# EasyEDA Pro project 000.1.CheeseCake_Special remake_AUX.epro

# Board Special remake_3
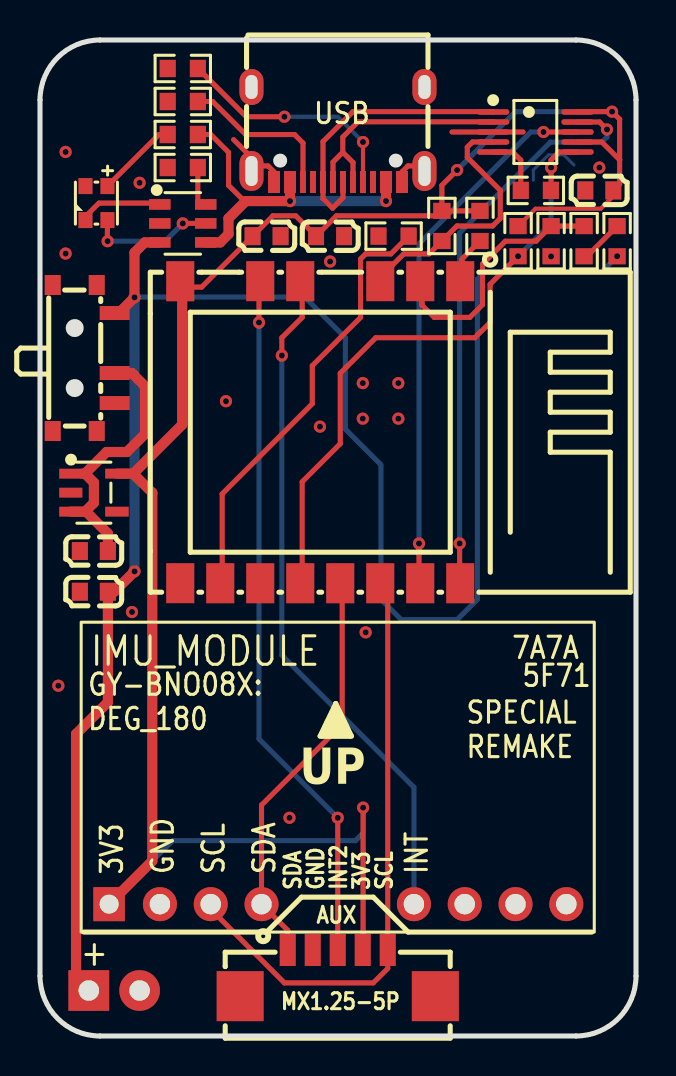
[diagram p0: board, top side]
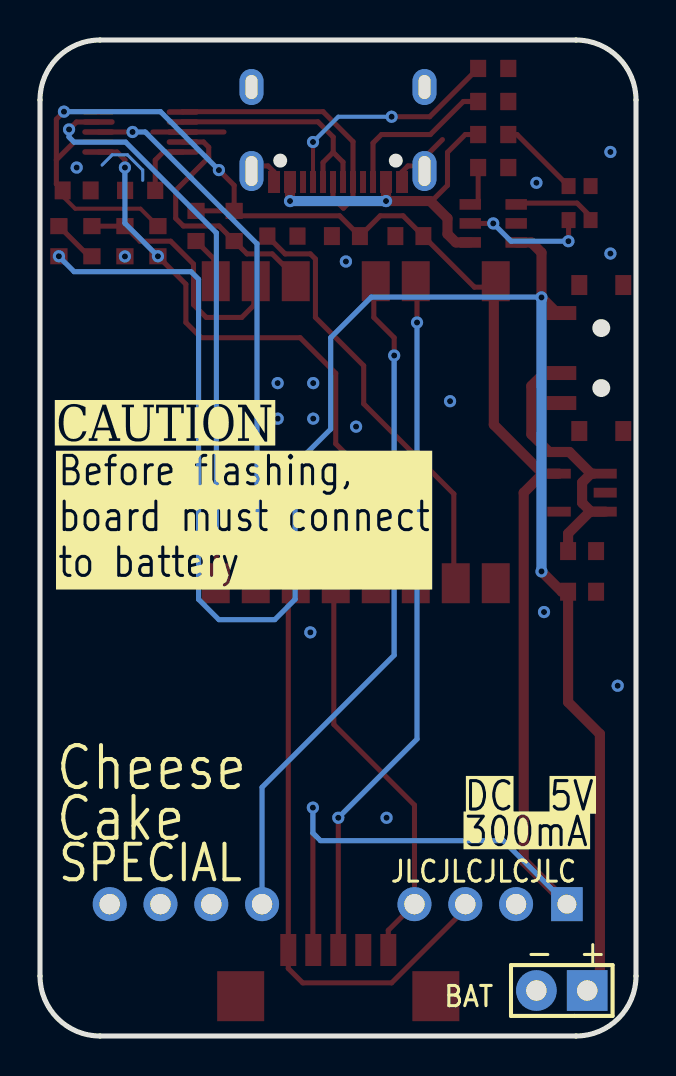
[diagram p1: board, bottom side, seen from below]

Outline 29.8 x 49.8 mm; copper layers: Top Layer, Bottom Layer. Coordinates in mm from the lower left corner of the outline.
Outline path: 0,46.8 arc(0.88,48.92) 3,49.8 26.8,49.8 arc(28.92,48.92) 29.8,46.8 29.8,3 arc(28.92,0.88) 26.8,0 3,0 arc(0.88,0.88) 0,3 0,46.8
Stack: Top Layer 0.035mm / Dielectric1 0.91mm FR4 er 4.5 / Bottom Layer 0.035mm

## Design rules (mm)
spacing Default (default): track to track 0.127, other pairs 0 to 0.127
track width Default (default): min 0.127, default 0.127, max 25.4
differential pair differentialPair (default): width min 0.127, default 0.254, max 2.54; gap min 0.152, default 0.152
via Default (default): diameter min 0.61, default 0.61, max 100.025; hole min 0.305, default 0.305, max 59.995
net GND uses gge20888(1)

## Placement (name value [footprint] x y rotation side)
BAT  HDR-M-2.54_1x2  [hdr-m-2.54_1x2]  3.71 2.28 0 bottom
C1  1uF  [C0603]  11.33 39.99 180 top
C2  100nF  [C0603]  14.5 39.99 180 top
C3  100nF  [C0603]  27.97 42.28 0 top
C5  1uF  [C0603]  2.69 24.25 0 top
CN1  HC-1.25-5PWT  [conn-smd_5p-p1.25_hctl_hc-1.25-5pwt]  14.89 3.29 0 top
CONN1  -  [hdr-th_10p-p2.54-v-m-1]  14.89 6.59 0 top
CP  10uF  [C0603]  2.69 22.21 0 top
ESP1  2.4GHz  [wifim-smd_esp-12f-esp8266mod]  13.36 30.19 180 top
LDO3V3  ME6211C33M5G-N  [SOT-23-5_L3.0-W1.7-P0.95-LS2.8-BL]  2.69 27.17 270 top
LED  NH-B2020RGBA-HF  [LED-ARRAY-SMD_4P-L2.1-W2.1-TL_NH-B2020RGBA]  2.82 41.65 90 top
P1  TP4057-42-SOT26-R  [SOT-23-6_L2.9-W1.6-P0.95-LS2.8-BL]  7.14 40.63 270 top
R1  4.7kΩ  [R0603]  20.09 40.5 90 top
R2  4.7kΩ  [R0603]  22 40.5 90 top
R3  4.7kΩ  [R0603]  23.9 39.74 90 top
R10  4.7kΩ  [R0603]  24.79 42.28 0 top
RA  3kΩ  [R0603]  7.14 43.42 180 top
RD  4.7kΩ  [R0603]  17.68 39.99 180 top
RD1  5.1kΩ  [R0603]  7.14 48.38 0 top
RD2  5.1kΩ  [R0603]  7.14 46.73 0 top
RL  1kΩ  [R0603]  7.14 45.07 0 top
RS  180kΩ  [R0603]  28.86 39.74 90 top
SW  SSSS811101  [SW-SMD_SSSS811101]  2.19 33.9 270 top
UART1  CH340X  [MSOP-10_L3.0-W3.0-P0.50-LS5.0-BL]  24.77 45.2 270 top
USB  TYPE-C 16PIN 2MD(073)  [USB-C-SMD_TYPE-C-6PIN-2MD-073]  14.9 45.07 180 top
VD1  220kΩ  [R0603]  27.21 39.74 270 top
VD2  100kΩ  [R0603]  25.55 39.74 90 top

## Footprints (pads in the part's own frame, mm; a bottom-side part is the same pattern mirrored in y, then rotated)
C0603
  rect 0.8x0.9 smd: 1(-0.7,0) 2(0.7,0)
conn-smd_5p-p1.25_hctl_hc-1.25-5pwt
  rect 0.8x1.6 smd: 1(-2.5,1.009) 2(-1.25,1.009) 3(0,1.009) 4(1.25,1.009) 5(2.5,1.009)
  rect 2.35x2.5 smd: 6(4.88,-1.3) 7(-4.88,-1.3)
hdr-m-2.54_1x2
  rect 2.032x2.032 hole 1.021: 1(-1.27,0)
  round 2.032 hole 1.021: 2(1.27,0)
hdr-th_10p-p2.54-v-m-1
  rect 1.575x1.7 hole 0.945: 1(-11.43,0)
  round 1.7 hole 1.02: 2(-8.89,0) 3(-6.35,0) 4(-3.81,0) 7(3.81,0) 8(6.35,0) 9(8.89,0) 10(11.43,0)
LED-ARRAY-SMD_4P-L2.1-W2.1-TL_NH-B2020RGBA
  rect 0.8x0.7 smd: 1(-0.85,0.55) 2(0.85,0.55) 3(0.85,-0.55) 4(-0.85,-0.55)
MSOP-10_L3.0-W3.0-P0.50-LS5.0-BL
  oval 0.28x1.62 smd: 1(-1,-2.11) 2(-0.5,-2.11) 3(0,-2.11) 4(0.5,-2.11) 5(1,-2.11) 6(1,2.11) 7(0.5,2.11) 8(0,2.11) 9(-0.5,2.11) 10(-1,2.11)
R0603
  rect 0.806x0.864 smd: 1(-0.753,0) 2(0.753,0)
SOT-23-5_L3.0-W1.7-P0.95-LS2.8-BL
  rect 0.49x1.157 smd: 1(-0.95,-1.153) 2(0,-1.153) 3(0.95,-1.153)
  rect 0.49x1.175 smd: 4(0.95,1.153) 5(-0.95,1.153)
SOT-23-6_L2.9-W1.6-P0.95-LS2.8-BL
  rect 0.532x1.072 smd: 1(-0.95,-1.149) 2(0,-1.149) 3(0.95,-1.149) 4(0.95,1.149) 5(0,1.149) 6(-0.95,1.149)
SW-SMD_SSSS811101
  rect 0.7x1.5 smd: 1(-2.25,1.55) 2(0.75,1.55) 3(2.25,1.55)
  rect 1x0.8 smd: 4(-3.65,0.65) 5(3.65,0.65) 6(3.65,-1.55) 7(-3.65,-1.55)
USB-C-SMD_TYPE-C-6PIN-2MD-073
  rect 0.6x1.1 smd: 1(-3.2,2.375) 2(-2.4,2.375) 11(2.4,2.375) 12(3.2,2.375)
  rect 0.3x1.1 smd: 3(-1.75,2.375) 4(-1.25,2.375) 5(-0.75,2.375) 6(-0.25,2.375) 7(0.25,2.375) 8(0.75,2.375) 9(1.25,2.375) 10(1.75,2.375)
  oval 1.2x2 hole 0.6x1.5: 13(-4.325,1.825) 14(4.325,1.825)
  oval 1.2x1.8 hole 0.6x1.2: 15(-4.325,-2.375) 16(4.325,-2.375)
wifim-smd_esp-12f-esp8266mod
  rect 1.4x2 smd: 1(-7.651,-7.551) 2(-5.651,-7.551) 3(-3.651,-7.551) 5(0.349,-7.551) 6(2.349,-7.551) 8(6.349,-7.551) 9(6.349,7.548) 10(4.349,7.55) 11(2.349,7.551) 12(0.349,7.551) 13(-1.651,7.55) 14(-3.651,7.551) 15(-5.651,7.551) 16(-7.651,7.551)

## Nets
3V3: C1.2 C2.2 C3.2 CN1.4 CONN1.1 ESP1.8 LDO3V3.5 R1.2 R2.2 R3.2 UART1.7 UART1.10
+5V: P1.4 RL.2 USB.2 USB.11
GND: BAT.2 C1.1 C2.1 C3.1 C5.1 CN1.2 CONN1.2 CP.1 ESP1.9 LDO3V3.2 P1.2 RA.2 RD.2 RD1.1 RD2.1 UART1.3 USB.1 USB.12 USB.13 USB.14 USB.15 USB.16 VD2.1
VIN: C5.2 LDO3V3.1 LDO3V3.3 SW.2
ADC: ESP1.2 VD1.1 VD2.2
BAT+: BAT.1 CP.2 P1.3 RS.1 SW.1
BTS: RS.2 VD1.2
DN: UART1.2 USB.5 USB.7
DP: UART1.1 USB.6 USB.8
EN: ESP1.3 R1.1 UART1.4
G: LED.4 P1.5
GPIO0: ESP1.12 R3.1 R10.2 UART1.6
GPIO15: ESP1.10 RD.1
INT: CONN1.7 ESP1.5
INT2: CN1.3 ESP1.6
LED: ESP1.11
P1_6: P1.6 RA.1
R: LED.1 P1.1
RD1_2: RD1.2 USB.4
RD2_2: RD2.2 USB.10
RL_1: LED.3 RL.1
RST: ESP1.1 R2.1
RX: ESP1.15 UART1.8
SCL: CN1.5 CONN1.3 ESP1.14
SDA: CN1.1 CONN1.4 ESP1.13
TX: ESP1.16 UART1.9
$1N28912: R10.1 UART1.5

Pads without a net: CN1 6 7; CONN1 8 9 10; LDO3V3 4; LED 2; SW 3 4 5 6 7; USB 3 9

## Via types
v1: diameter 0.61, hole 0.305, Top Layer to Bottom Layer, 37 vias

## Routing (per net, layer and track width the routed paths; a pad name or vN(x,y) marks a point on that pad's centre or on a via; arc(x,y) is an arc through that point)
3V3: length 99.3
  Top Layer w0.203: C3.2 28.67,41.99 28.04,41.37 24.78,41.37 R3.2
  Top Layer w0.254: 28.98,43.8 28.09,44.7 UART1.7 ; 28.98,43.8 28.98,45.84 v1(28.6,46.22) 26.89,46.22 UART1.10 ; 28.98,43.8 28.98,42.6 C3.2 ; v1(16.16,11.42) 16.16,4.32 CN1.4 ; v1(20.86,43.3) 20.09,42.53 R1.2 ; R1.2 19.85,41.01 14.82,41.01 C2.2 12.79,41.01 11.65,41.01 C1.2 8.08,37.44 7.11,37.44 ; R1.2 R2.2
  Top Layer w0.508: CONN1.1 5.62,8.75 5.62,27.16 4.66,28.12 ; 7.11,37.44 7.11,30.57 4.66,28.12 ; LDO3V3.5 4.66,28.12
  Bottom Layer w0.254: v1(28.6,46.22) 23.78,46.22 v1(20.86,43.3) ; v1(16.16,11.42) 16.16,10.15 15.78,9.77 6.63,9.77 CONN1.1
+5V: length 17.4
  Top Layer w0.254: RL.2 8.54,45.07 9.43,44.19 9.43,42.53 10.21,41.75
  Top Layer w0.508: 12.5,42.95 v1(12.5,41.75) 10.29,41.75 9.43,40.88 9.43,40.1 9.01,39.68 P1.4 ; v1(17.3,41.75) 17.3,42.95
  Bottom Layer w0.508: v1(17.3,41.75) v1(12.5,41.75)
GND: length 11.3
  Top Layer w0.254: 18.1,42.95 18.1,43.21 18.4,43.5 19.22,43.5 ; 20.6,45.2 UART1.3 24.16,45.2 ; 9.68,44.82 10.58,43.92 10.58,43.5 11.4,43.5 11.7,43.21 11.7,42.95
  Bottom Layer w0.152: 26.7,43.55 26.19,44.06 25.42,44.06 24.66,43.3 24.66,42.79
  vias: v1(0.92,17.52) v1(1.28,44.2) v1(1.28,39.12) v1(4.6,21.2) v1(4.98,42.66) v1(9.3,31.74) v1(12.47,10.91) v1(14,30.47) v1(14.5,38.72) v1(16.14,32.65) v1(16.14,30.87) v1(16.28,20.18) v1(17.92,32.65) v1(17.92,30.87) v1(25.55,38.98) v1(27.97,43.42)
VIN: length 14.3
  Top Layer w0.254: LDO3V3.1 2.12,28.12
  Top Layer w0.508: 2.25,28.12 3.33,29.2 4.34,29.2 5.23,30.09 5.23,32.5 4.58,33.15 3.61,33.15 ; 2.25,28.12 2.25,28.12 2.69,27.68 2.69,26.66 2.25,26.22 ; 2.25,28.12 2.12,28.12 ; LDO3V3.3 2.25,26.22 ; 2.25,26.22 2.3,26.22 3.39,25.13 C5.2
ADC: length 12.3
  Top Layer w0.254: VD1.1 VD2.2 24.8,39.74 23.27,39.74 22.12,38.6 22.12,36.57 21.49,35.93 19.71,35.93 19.11,36.53 19.11,37.44
BAT+: length 95.8
  Top Layer w0.508: BAT.1 1.81,2.91 1.81,15.1 3.39,16.69 CP.2 3.71,22.21 v1(4.73,23.23) ; P1.3 5.23,39.68 4.73,39.17 v1(4.73,36.93) 3.95,36.15 3.61,36.15
  Bottom Layer w0.254: v1(4.73,36.93) 4.74,36.95 13.24,36.95 15.27,34.91 15.27,30.34 17.05,28.56 17.05,21.83 18.06,20.82 20.86,20.82 21.87,21.83 21.87,37.84 22.25,38.22 28.09,38.22 28.86,38.98 v1(28.86,38.99)
  Bottom Layer w0.508: v1(4.73,36.93) v1(4.73,23.23)
BTS: length 2.3
  Top Layer w0.254: RS.2 27.35,38.99 VD1.2
DN: length 11.5
  Top Layer w0.254: 15.14,44.19 15.14,44.95 15.9,45.71 22.67,45.71 22.68,45.7 ; 15.14,44.19 15.65,43.68 15.65,42.95 ; 15.14,44.19 14.65,43.7 14.65,42.95
DP: length 14.5
  Top Layer w0.254: 14.15,42.95 14.15,44.72 15.65,46.22 22.67,46.22 22.68,46.2 ; 14.15,42.95 14.15,41.87 14.63,41.39 15.15,41.91 15.15,42.95
EN: length 13.3
  Top Layer w0.254: UART1.4 21.62,44.7 21.36,44.44 21.36,43.93 23.01,42.28 23.01,40.88 22.63,40.5 20.85,40.5 R1.1 19.45,39.11 18.19,39.11 17.11,38.03 17.11,37.44
G: length 6.3
  Top Layer w0.254: LED.4 3.37,39.91 3.38,39.9 v1(3.38,39.74) ; P1.5 v1(7.14,40.63)
  Bottom Layer w0.254: v1(3.38,39.74) 6.25,39.74 v1(7.14,40.63)
GPIO0: length 32.2
  Top Layer w0.254: 13.11,22.34 13.11,27.71 15.01,29.61 15.01,33.14 16.79,34.91 21.74,34.91 22.51,35.68 22.51,37.59 v1(23.9,38.99) ; R10.2 25.55,42.29 v1(25.55,43.42) 25.55,43.8 25.95,44.2 UART1.6
  Bottom Layer w0.254: v1(23.9,38.99) 25.55,40.64 v1(25.55,43.42)
GPIO15: length 22.3
  Top Layer w0.254: RD.1 17.54,39.11 16.28,39.11 16.03,38.85 16.03,35.93 13.62,33.52 13.62,31.61 9.11,27.11 9.11,22.34
INT: length 34.1
  Top Layer w0.254: 13.11,37.44 13.11,35.93 12.09,34.91 v1(12.09,34.03)
  Bottom Layer w0.254: v1(12.09,34.03) 12.09,19.04 18.7,12.44 18.7,6.47
INT2: length 35.1
  Top Layer w0.254: v1(10.95,35.68) 10.95,37.68 ESP1.6 ; v1(14.89,10.91) CN1.3
  Bottom Layer w0.254: v1(14.89,10.91) 10.95,14.85 v1(10.95,35.68)
P1_6: length 2.1
  Top Layer w0.254: RA.1 7.89,41.78 8.09,41.58 P1.6
R: length 4.2
  Top Layer w0.254: 2.27,40.8 2.27,40.97 2.95,41.65 5.92,41.65 P1.1
RD1_2: length 11.5
  Top Layer w0.203: 16.15,42.95 v1(16.15,44.7)
  Top Layer w0.254: RD1.2 7.9,48.38 10.31,45.96 v1(12.22,45.96)
  Bottom Layer w0.203: v1(12.22,45.96) 14.89,45.96 v1(16.15,44.7)
RD2_2: length 7.8
  Top Layer w0.254: 13.15,42.95 13.15,44.65 12.73,45.07 10.28,45.07 8.63,46.73 RD2.2
RL_1: length 4.1
  Top Layer w0.254: LED.3 5.95,45.07 RL.1
RST: length 2.7
  Top Layer w0.254: 21.11,37.44 21.11,38.86 R2.1
RX: length 27.2
  Top Layer w0.254: v1(18.95,24.63) 18.95,22.7 ESP1.15 ; v1(25.17,45.2) UART1.8
  Bottom Layer w0.254: v1(25.17,45.2) 24.54,45.2 18.95,39.61 v1(18.95,24.63)
SCL: length 30
  Top Layer w0.254: 17.11,22.34 17.39,22.06 CN1.5 17.39,3.38 16.66,2.66 12.22,2.66 8.54,6.34 CONN1.3
SDA: length 20.3
  Top Layer w0.254: 15.11,22.34 15.11,15.58 11.08,11.55 CONN1.4 12.39,5.28 CN1.1
TX: length 28.9
  Top Layer w0.254: v1(20.98,24.63) 20.98,22.67 ESP1.16 ; UART1.9 27.97,45.7 v1(28.35,45.33)
  Bottom Layer w0.254: v1(20.98,24.63) 20.98,40.16 25.52,44.69 28.09,44.69 28.35,44.95 v1(28.35,45.33)
$1N28912: length 3.1
  Top Layer w0.254: R10.1 24.04,43.8 23.63,44.2 UART1.5

## Copper pours and planes (outline as drawn; the poured copper is in the pictures)
GND on Top Layer: -4.29,52.44 32.41,52.44 32.41,-2.55 -4.29,-2.55
GND on Bottom Layer: -7.85,51.17 31.52,51.17 31.52,-2.17 -7.85,-2.17

## Text on the board
Bottom Silkscreen Layer: JLCJLCJLCJLC | + | - | 5V | DC | 300mA | Before flashing, / board must connect / to battery | SPECIAL | Cheese | Cake | CAUTION
Document Layer: Y | TP4057:3K / FM4057:10K
Top Solder Mask Layer: ▲
Top Silkscreen Layer: SDA | GND | INT2 | 3V3 | SCL | MX1.25-5P | AUX | GY-BNO08X: / DEG_180 | INT | SPECIAL / REMAKE | 7A7A | 5F71 | + | IMU_MODULE | UP | ▲
